# EasyEDA schematic 1-Schematic_BlinkingLightBoard.json
TITLE: Sheet_1; REV: 1.0; Date: 2023-10-25; Sheet: 1/1; Drawn By: adammillion2006; Company: Your Company
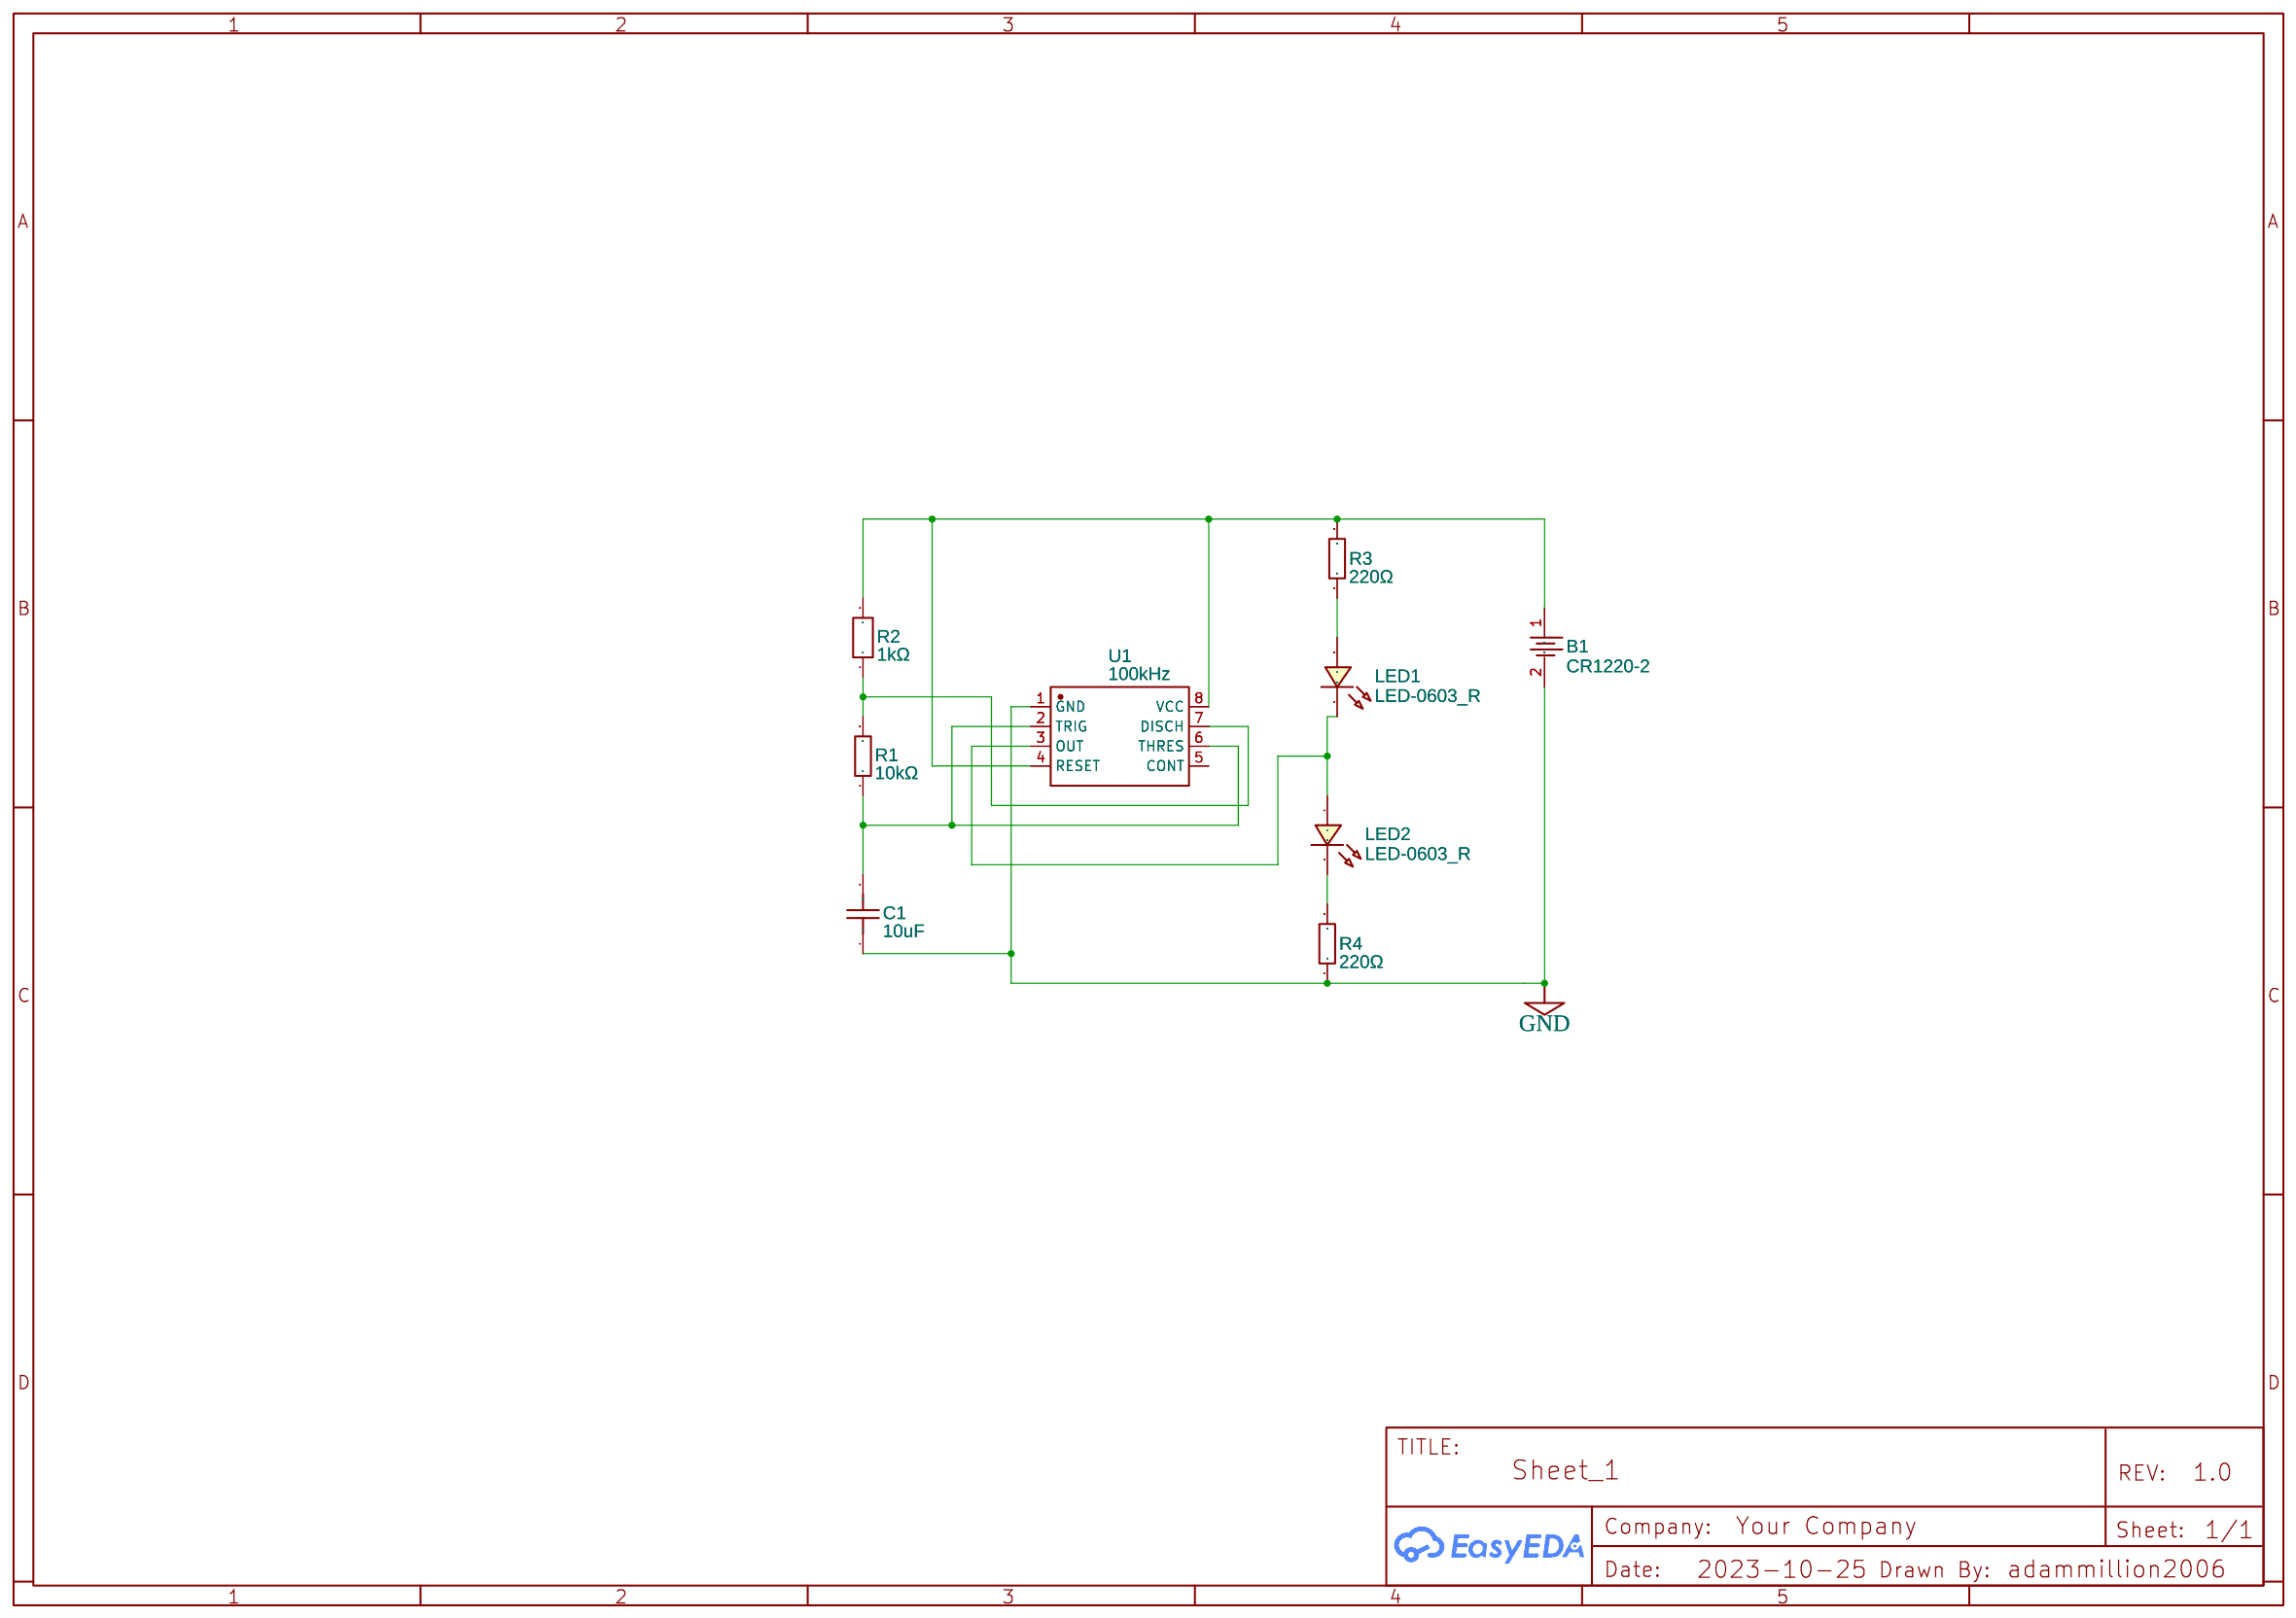
[diagram p0: schematic sheet]

## Parts
B1  CR1220-2  [BAT-SMD_CR1220-2]
C1  10uF  [C0402]
LED1  LED-0603_R  [LED0603_RED]
LED2  LED-0603_R  [LED0603_RED]
R1  10kΩ  [RES-TH_BD1.9-L3.3-P7.30-D0.5]
R2  1kΩ  [RES-TH_BD2.4-L6.3-P10.30-D0.6]
R3  220Ω  [RES-TH_BD8.0-L23.5-P27.50-D0.8]
R4  220Ω  [RES-TH_BD8.0-L23.5-P27.50-D0.8]
U1  100kHz  [DIP-8_L9.8-W6.6-P2.54-LS7.6-BL]

## Library data of the parts
B1 = CR1220-2: Supplier: LCSC; Manufacturer: Q&J; image: //image.lceda.cn/szlcsc/C70381.jpg; Supplier Part: C70381
C1 = GRM155R60J106ME05D: Contributor: LCSC; Supplier: LCSC; Supplier Part: C723895; Manufacturer: muRata(村田); JLCPCB Part Class: Extended Part; link: https://lcsc.com/eda_search?q=C723895&%26type=1&ref=editor
LED1 LED2 = LED-0603_R: Manufacturer: EVERLIGHT(台湾亿光); Manufacturer Part: 19-217/R6C-AL1M2VY/3T; Supplier Part: C72044; Supplier: LCSC; Contributor: LCEDA_01
R1 = MFR-12FTE52-10K: Contributor: LCSC; Supplier: LCSC; Supplier Part: C172889; Manufacturer: YAGEO(国巨); JLCPCB Part Class: Extended Part; link: https://lcsc.com/eda_search?q=C172889&%26type=1&ref=editor
R2 = MF0207FTE52-1K: Contributor: lcsc; Supplier: LCSC; Supplier Part: C513706; Manufacturer: YAGEO(国巨); JLCPCB Part Class: Extended Part; link: https://lcsc.com/eda_search?q=C513706&%26type=1&ref=editor
R3 R4 = EWWR0006J220RT9: Contributor: LCSC; Supplier: LCSC; Supplier Part: C348961; Manufacturer: RESI(开步睿思）; JLCPCB Part Class: Extended Part; link: https://lcsc.com/eda_search?q=C348961&%26type=1&ref=editor
U1 = NE555P: Supplier: LCSC; Manufacturer: TI(德州仪器); Supplier Part: C46749; JLCPCB Part Class: Extended Part; link: https://lcsc.com/eda_search?q=C46749&%26type=1&ref=editor

## Nets
GND: B1.2 C1.1 R4.1 U1.1(GND)
Net-(B1-1): B1.1 R2.2 R3.2 U1.4(RESET) U1.8(VCC)
Net-(C1-2): C1.2 R1.1 U1.2(TRIG) U1.6(THRES)
Net-(LED1-1): LED1.1 R3.1
Net-(LED1-2): LED1.2 LED2.1 U1.3(OUT)
Net-(LED2-2): LED2.2 R4.2
Net-(R1-2): R1.2 R2.1 U1.7(DISCH)

Not connected (* = marked no-connect by the designer): U1 5(CONT)
